# EasyEDA Pro project G3108.eprj

# Schematic Schematic1
Board Name: Board1; Create Date: 2025-11-01; Page Name: P1; Project Name: G3108; Schematic Name: Schematic1; Update Date: 2025-11-01; Company: 嘉立创EDA; Page Size: A4; Version: V1.0
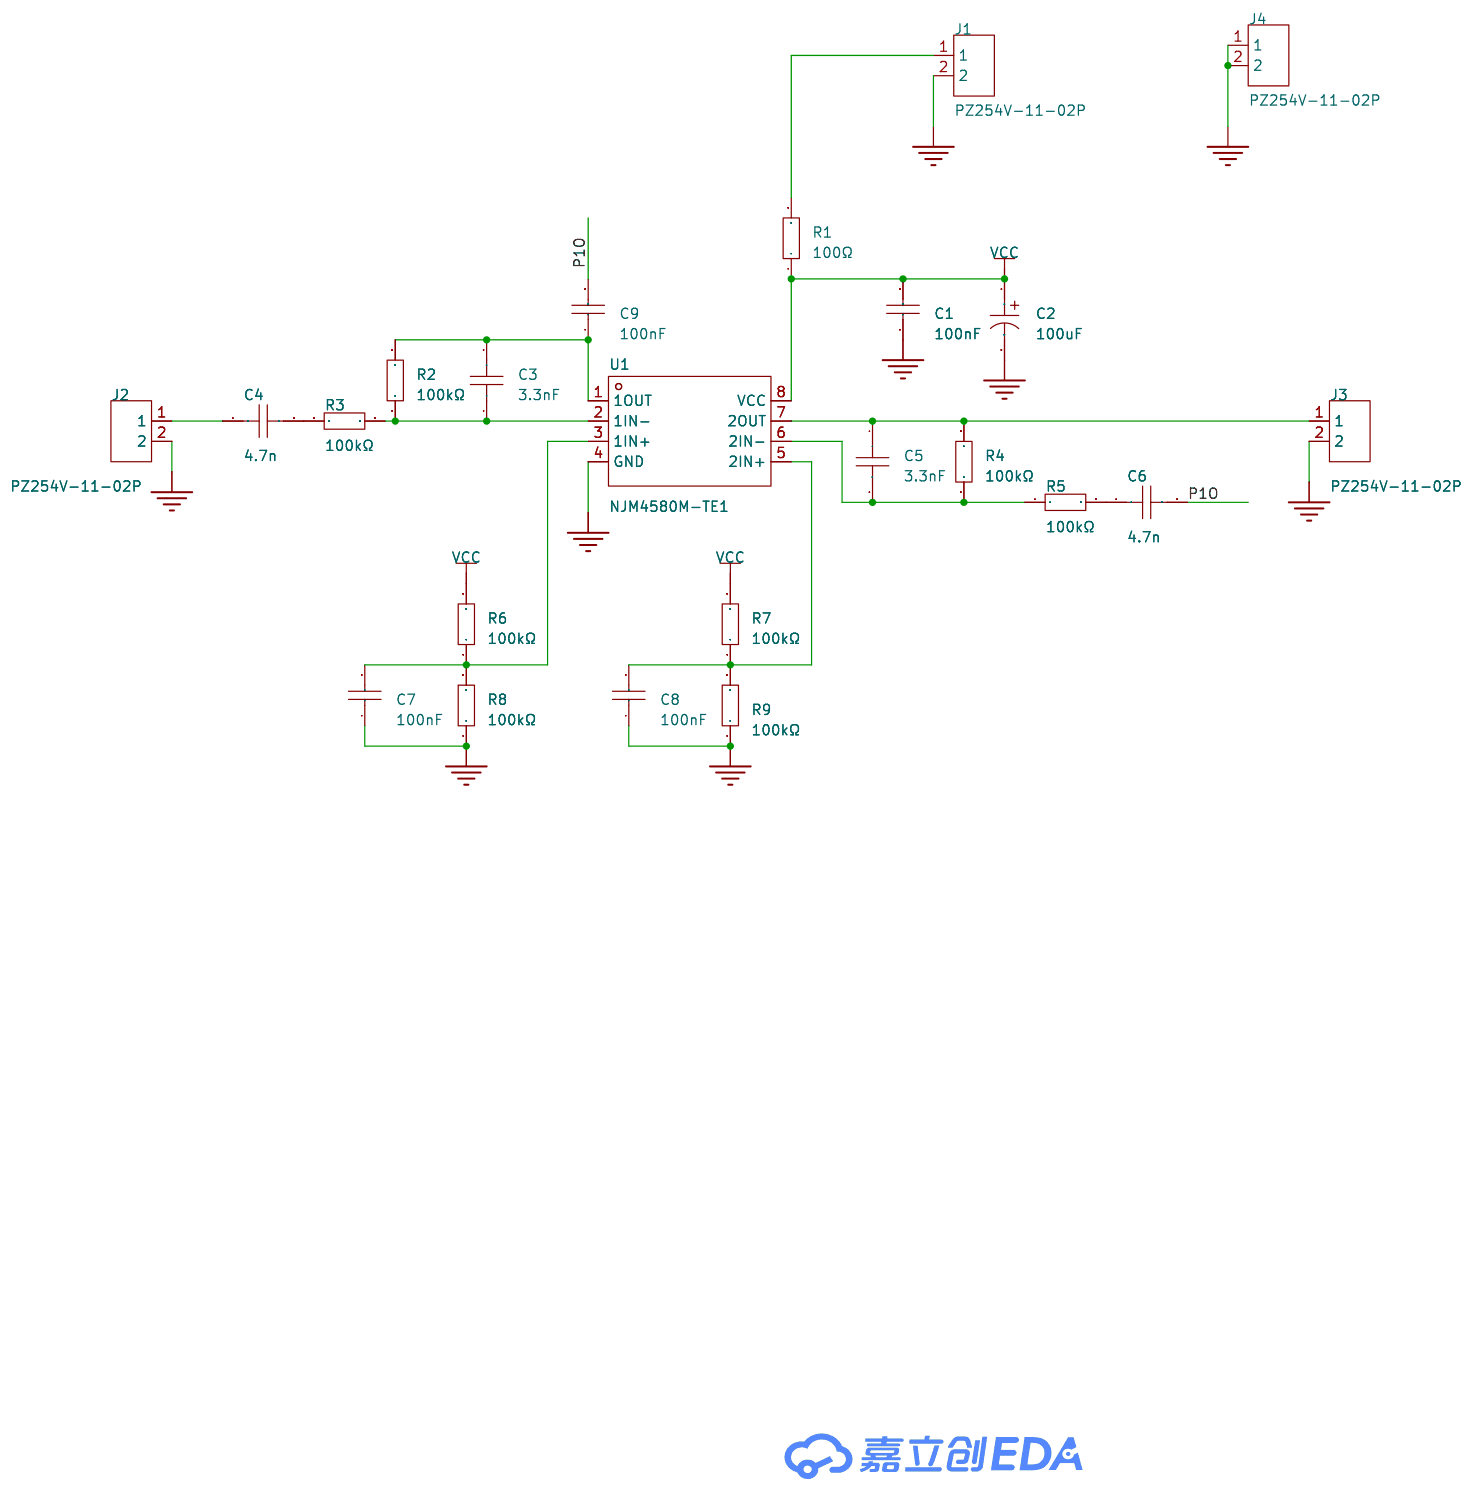
[diagram p0: schematic sheet]

## Parts
C1  100nF  [C0603]
C2  100uF  [CAP-SMD_L3.2-W1.6]
C3  3.3nF  [C0603]
C4  4.7n  [C0603]
C5  3.3nF  [C0603]
C6  4.7n  [C0603]
C7  100nF  [C0603]
C8  100nF  [C0603]
C9  100nF  [C0603]
J1  PZ254V-11-02P  [HDR-TH_2P-P2.54-V-M]
J2  PZ254V-11-02P  [HDR-TH_2P-P2.54-V-M]
J3  PZ254V-11-02P  [HDR-TH_2P-P2.54-V-M]
J4  PZ254V-11-02P  [HDR-TH_2P-P2.54-V-M]
R1  100Ω  [R0603]
R2  100kΩ  [R0603]
R3  100kΩ  [R0603]
R4  100kΩ  [R0603]
R5  100kΩ  [R0603]
R6  100kΩ  [R0603]
R7  100kΩ  [R0603]
R8  100kΩ  [R0603]
R9  100kΩ  [R0603]
U1  NJM4580M-TE1  [SO-8_L5.2-W4.4-P1.27-LS7.0-BL]

## Library data of the parts
C1 C7-C9 = CC0603JRX7R9BB104: LCSC Part Name: 100nF ±5% 50V; Supplier Part: C91183; Manufacturer: YAGEO(国巨); Supplier Footprint: 0603; JLCPCB Part Class: 扩展库; Datasheet: https://atta.szlcsc.com/upload/public/pdf/source/20170919/C131031_1505787245477976978.pdf; Supplier: LCSC; Tolerance: ±5%; Voltage Rated: 50V; Temperature Coefficient: X7R
C2 = T55A107M007C0070: LCSC Part Name: 100uF ±20% 7V; Supplier Part: C511414; Manufacturer: VISHAY(威世); Supplier Footprint: CASE-A-3216; JLCPCB Part Class: 扩展库; Datasheet: https://atta.szlcsc.com/upload/public/pdf/source/20200408/C511414_1A143546979F258AA220839DCB43601D.pdf; Supplier: LCSC; Tolerance: ±20%; Voltage Rating: 7V; Equivalent Series Resistance(ESR): 70mΩ@100kHz; Operating Temperature: -55℃~+105℃
C3-C6 = CC0603FRNPO9BN332: LCSC Part Name: 3.3nF ±1% 50V; Supplier Part: C5182463; Manufacturer: YAGEO(国巨); Supplier Footprint: 0603; JLCPCB Part Class: 扩展库; Datasheet: https://item.szlcsc.com/datasheet/CC0603FRNPO9BN332/5843509.html; Supplier: LCSC; Tolerance: ±1%; Voltage Rating: 50V; Temperature Coefficient: NP0
J1-J4 = PZ254V-11-02P: LCSC Part Name: 1x2P 间距:2.54mm 方针 直插; Supplier Part: C492401; Manufacturer: XFCN(兴飞); Supplier Footprint: 插件,P=2.54mm; JLCPCB Part Class: 扩展库; Datasheet: https://item.szlcsc.com/datasheet/PZ254V-11-02P/502957.html; Supplier: LCSC; Pin Structure: 1x2P; Pitch: 2.54mm; Circluar Pins/Square Pins: 方针; Mounting Type: 直插; Number of Rows: 单排; Number of Pins: 2P; Length of Mating Pin: 6mm; Insulation Height: 2.5mm; Length of End Connection Pin: 3mm; Contact Material: 黄铜; Operating Temperature: -40℃~+105℃; Color: 黑色
R1 = RC0603FR-07100RL: LCSC Part Name: 厚膜电阻 100Ω ±1% 100mW; Supplier Part: C105588; Manufacturer: YAGEO(国巨); Supplier Footprint: 0603; JLCPCB Part Class: 扩展库; Datasheet: https://atta.szlcsc.com/upload/public/pdf/source/20180316/70C0E2BDAE7FCC62C531A5A58D202EE1.pdf; Supplier: LCSC; Type: 厚膜电阻; Tolerance: ±1%; Power(Watts): 100mW; Overload Voltage (Max): 75V; Temperature Coefficient: ±100ppm/℃; Operating Temperature Range: -55℃~+155℃
R2-R9 = RC0603FR-07100KL: LCSC Part Name: 厚膜电阻 100kΩ ±1% 100mW; Supplier Part: C14675; Manufacturer: YAGEO(国巨); Supplier Footprint: 0603; JLCPCB Part Class: 扩展库; Datasheet: https://atta.szlcsc.com/upload/public/pdf/source/20140324/1457707028752.pdf; Supplier: LCSC; Type: 厚膜电阻; Tolerance: ±1%; Power(Watts): 100mW; Overload Voltage (Max): 75V; Temperature Coefficient: ±100ppm/℃; Operating Temperature Range: -55℃~+155℃
U1 = NJM4580M-TE1: Supplier Part: C8682; Manufacturer: JRC; Supplier Footprint: DMP-8; JLCPCB Part Class: 扩展库; Datasheet: https://item.szlcsc.com/datasheet/NJM4580M-TE1/9186.html; Supplier: LCSC; Number of Channels: 双路; Maximum Power Supply Range (Vdd-Vss): 36V; Gain Bandwidth Product: 15MHz; Vos - Input Offset Voltage: 3mV; Slew Rate: 5V/us; Ib - Input Bias Current: 200nA; Input Offset Current(Ios): 200nA; Common Mode Rejection Ratio(CMRR): 80dB; Operating Temperature: -40℃~+85℃; Dual Supply: 2V~18V；-18V~-2V

## Nets
GND: C1.1 C2.2 C7.1 C8.1 J1.2 J2.2 J3.2 J4.1 J4.2 R8.1 R9.1 U1.4(GND)
VCC: C1.2 C2.1 R1.1 R6.2 R7.2 U1.8(VCC)
P1O: C6.2 C9.2
$1N586: C4.2 R3.1
$1N1004: C7.2 R6.1 R8.2 U1.3(1IN+)
$1N1029: C3.1 R2.1 R3.2 U1.2(1IN-)
$1N1079: C3.2 C9.1 R2.2 U1.1(1OUT)
$1N1088: C6.1 R5.2
$1N1242: C8.2 R7.1 R9.2 U1.5(2IN+)
$1N1264: C5.1 J3.1 R4.2 U1.7(2OUT)
$1N1271: C5.2 R4.1 R5.1 U1.6(2IN-)
$1N1462: C4.1 J2.1
$1N1643: J1.1 R1.2

# Board PCB1
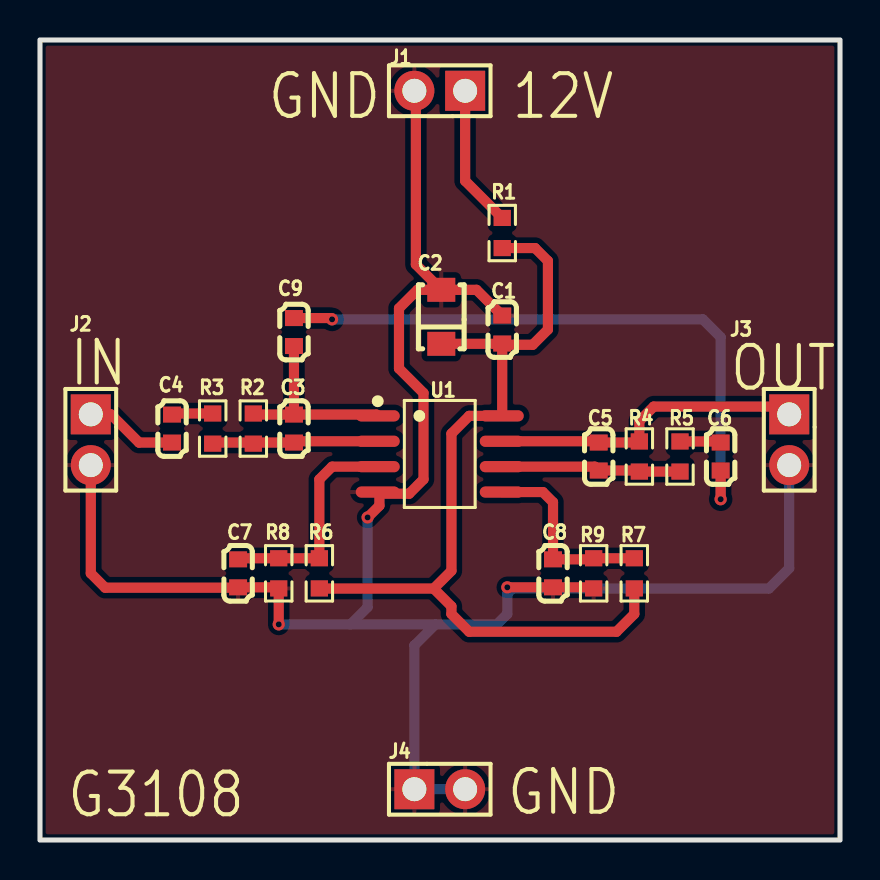
[diagram p1: board, top side]
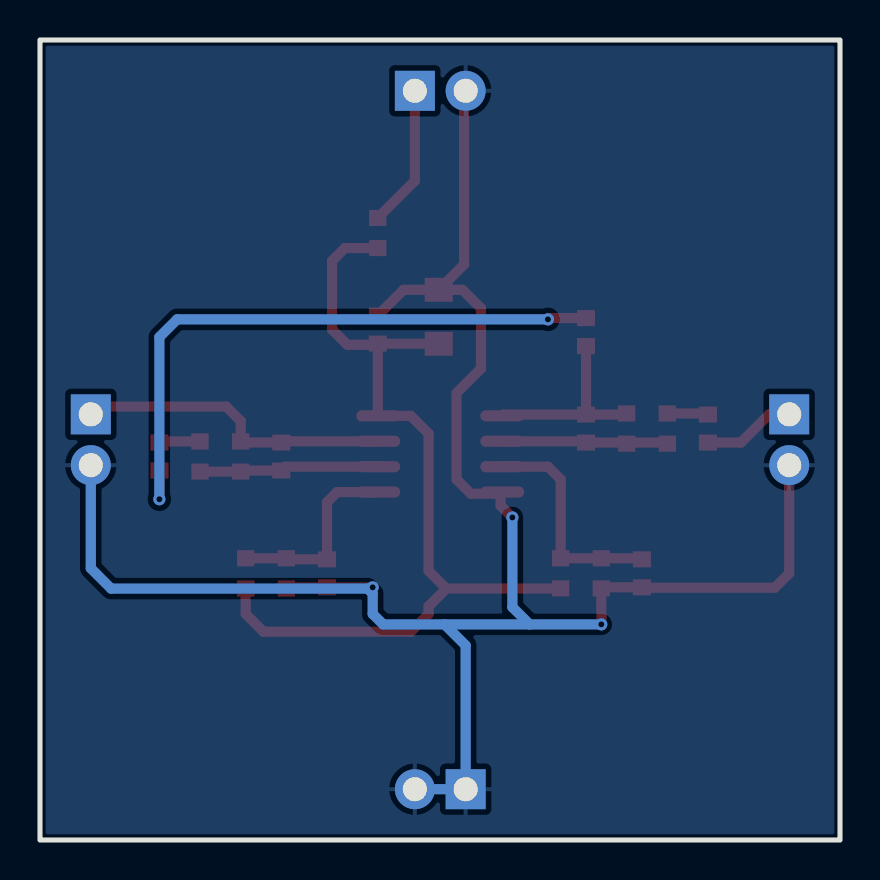
[diagram p2: board, bottom side, seen from below]

Outline 40 x 40 mm; copper layers: Top Layer, Bottom Layer. Coordinates in mm from the lower left corner of the outline.
Outline path: rectangle 0,40 40,0
Stack: Top Layer 0.035mm / Dielectric1 1.51mm FR4 er 4.5 / Bottom Layer 0.035mm

## Design rules (mm)
template: 自定义配置
spacing copperThickness1oz (default): track to track 0.102, other pairs 0.152 to 0.3
spacing copperThickness2oz: track to track 0.203, other pairs 0.152 to 0.3
track width copperThickness1oz (default): min 0.127, default 0.254, max 2.54
track width copperThickness2oz: min 0.203, default 0.508, max 2.54
differential pair differentialPair (default): width min 0.127, default 0.254, max 2.54; gap min 0.152, default 0.152
via viaSize (default): diameter min 0.5, default 0.61, max 10; hole min 0.3, default 0.305, max 6.3

## Placement (name value [footprint] x y rotation side)
C1  100nF  [C0603]  23.11 25.53 270 top
C2  100uF  [CAP-SMD_L3.2-W1.6]  20.07 26.16 90 top
C3  3.3nF  [C0603]  12.7 20.57 90 top
C4  4.7n  [C0603]  6.6 20.57 90 top
C5  3.3nF  [C0603]  27.94 19.18 270 top
C6  4.7n  [C0603]  34.04 19.18 270 top
C7  100nF  [C0603]  9.91 13.33 90 top
C8  100nF  [C0603]  25.65 13.33 90 top
C9  100nF  [C0603]  12.7 25.4 90 top
J1  PZ254V-11-02P  [HDR-TH_2P-P2.54-V-M]  19.99 37.46 180 top
J2  PZ254V-11-02P  [HDR-TH_2P-P2.54-V-M]  2.54 20.02 270 top
J3  PZ254V-11-02P  [HDR-TH_2P-P2.54-V-M]  37.47 20.02 270 top
J4  PZ254V-11-02P  [HDR-TH_2P-P2.54-V-M]  19.99 2.54 0 top
R1  100Ω  [R0603]  23.11 30.35 90 top
R2  100kΩ  [R0603]  10.67 20.57 90 top
R3  100kΩ  [R0603]  8.64 20.57 270 top
R4  100kΩ  [R0603]  29.97 19.18 90 top
R5  100kΩ  [R0603]  32 19.18 90 top
R6  100kΩ  [R0603]  13.97 13.33 270 top
R7  100kΩ  [R0603]  29.72 13.33 270 top
R8  100kΩ  [R0603]  11.94 13.33 90 top
R9  100kΩ  [R0603]  27.69 13.33 90 top
U1  NJM4580M-TE1  [SO-8_L5.2-W4.4-P1.27-LS7.0-BL]  19.99 19.3 270 top

## Footprints (pads in the part's own frame, mm; a bottom-side part is the same pattern mirrored in y, then rotated)
C0603
  rect 0.8x0.9 smd: 1(-0.7,0) 2(0.7,0)
CAP-SMD_L3.2-W1.6
  rect 1.2x1.4 smd: 1(-1.35,0) 2(1.35,0)
HDR-TH_2P-P2.54-V-M
  rect 2x2 hole 1.2: 1(-1.27,0)
  round 2 hole 1.2: 2(1.27,0)
R0603
  rect 0.806x0.864 smd: 1(-0.753,0) 2(0.753,0)
SO-8_L5.2-W4.4-P1.27-LS7.0-BL
  oval 0.56x2.2 smd: 1(-1.905,-3.1) 2(-0.635,-3.1) 3(0.635,-3.1) 4(1.905,-3.1) 5(1.905,3.1) 6(0.635,3.1) 7(-0.635,3.1) 8(-1.905,3.1)

## Nets
As in the schematic.

## Via types
v1: diameter 0.61, hole 0.305, Top Layer to Bottom Layer, 5 vias

## Routing (per net, layer and track width the routed paths; a pad name or vN(x,y) marks a point on that pad's centre or on a via; arc(x,y) is an arc through that point)
GND: length 100.6
  Top Layer w0.508: C1.1 21.83,27.51 20.07,27.51 ; v1(11.94,10.78) R8.1 11.88,12.63 10.12,12.63 ; 20.07,27.51 18.88,27.51 17.95,26.59 17.95,23.58 19.18,22.35 19.18,18.03 18.46,17.32 16.97,17.32 ; 20.07,27.51 18.8,28.78 18.8,37.39 J1.2 ; J2.2 2.54,13.33 3.26,12.62 10.1,12.62 10.12,12.63 ; 10.12,12.63 C7.1 ; v1(16.38,16.13) 16.97,16.72 16.97,17.32 ; v1(23.37,12.63) C8.1 27.63,12.63 R9.1 ; 16.97,17.32 U1.4
  Bottom Layer w0.508: 15.52,10.78 19.77,10.78 ; 15.52,10.78 16.38,11.64 v1(16.38,16.13) ; 15.52,10.78 v1(11.94,10.78) ; 19.77,10.78 18.72,9.73 J4.1 J4.2 ; 19.77,10.78 22.85,10.78 23.37,11.3 23.37,12.32 23.62,12.57 36.45,12.57 37.47,13.59 J3.2
VCC: length 44.8
  Top Layer w0.508: C1.2 23.1,24.81 ; 23.1,24.81 C2.1 ; 23.1,24.81 23.11,24.8 ; R6.2 13.98,12.57 19.69,12.57 ; 23.11,24.8 23.15,24.77 24.64,24.77 25.4,25.53 25.4,28.96 24.76,29.6 R1.1 ; 23.11,24.8 23.11,21.23 U1.8 21.46,21.21 20.57,20.32 20.57,13.46 19.69,12.57 ; 19.69,12.57 20.57,11.68 20.57,11.3 21.46,10.41 28.83,10.41 29.72,11.3 R7.2
P1O: length 31.3
  Top Layer w0.508: C6.2 v1(34.04,17.04) ; C9.2 14.54,26.1 v1(14.6,26.03)
  Bottom Layer w0.508: v1(34.04,17.04) 34.04,25.15 33.15,26.03 v1(14.6,26.03)
$1N586: length 2.1
  Top Layer w0.508: R3.1 6.66,21.33 C4.2
$1N1004: length 11.2
  Top Layer w0.508: C7.2 9.96,14.09 R8.2 R6.1 13.97,18.03 14.6,18.67 U1.3
$1N1029: length 8.3
  Top Layer w0.508: R3.2 8.69,19.87 C3.1 12.76,19.94 U1.2
$1N1079: length 9.7
  Top Layer w0.508: R2.2 10.72,21.27 C3.2 ; C3.2 16.82,21.27 U1.1 ; C3.2 C9.1
$1N1088: length 2.1
  Top Layer w0.508: R5.2 33.98,19.93 C6.1
$1N1242: length 9.7
  Top Layer w0.508: U1.5 25.15,17.4 25.65,16.89 C8.2 27.63,14.03 R9.2 R7.1
$1N1264: length 15.9
  Top Layer w0.508: J3.1 37.08,21.67 30.69,21.67 29.97,20.95 R4.2 29.92,19.88 C5.1 27.88,19.94 U1.7
$1N1271: length 9
  Top Layer w0.508: R5.1 R4.1 29.92,18.48 C5.2 27.75,18.67 U1.6
$1N1462: length 4.6
  Top Layer w0.508: C4.1 4.95,19.87 3.54,21.28 J2.1
$1N1643: length 7.1
  Top Layer w0.508: R1.2 21.26,32.96 J1.1

## Copper pours and planes (outline as drawn; the poured copper is in the pictures)
GND on Top Layer: 0,40 40,40 40,0 0,0
GND on Bottom Layer: 0,40 40,40 40,0 0,0

## Text on the board
Top Silkscreen Layer: G3108 | IN | GND | 12V | OUT
